# Altium schematic sheet IP6518C供电.SchDoc
size A2
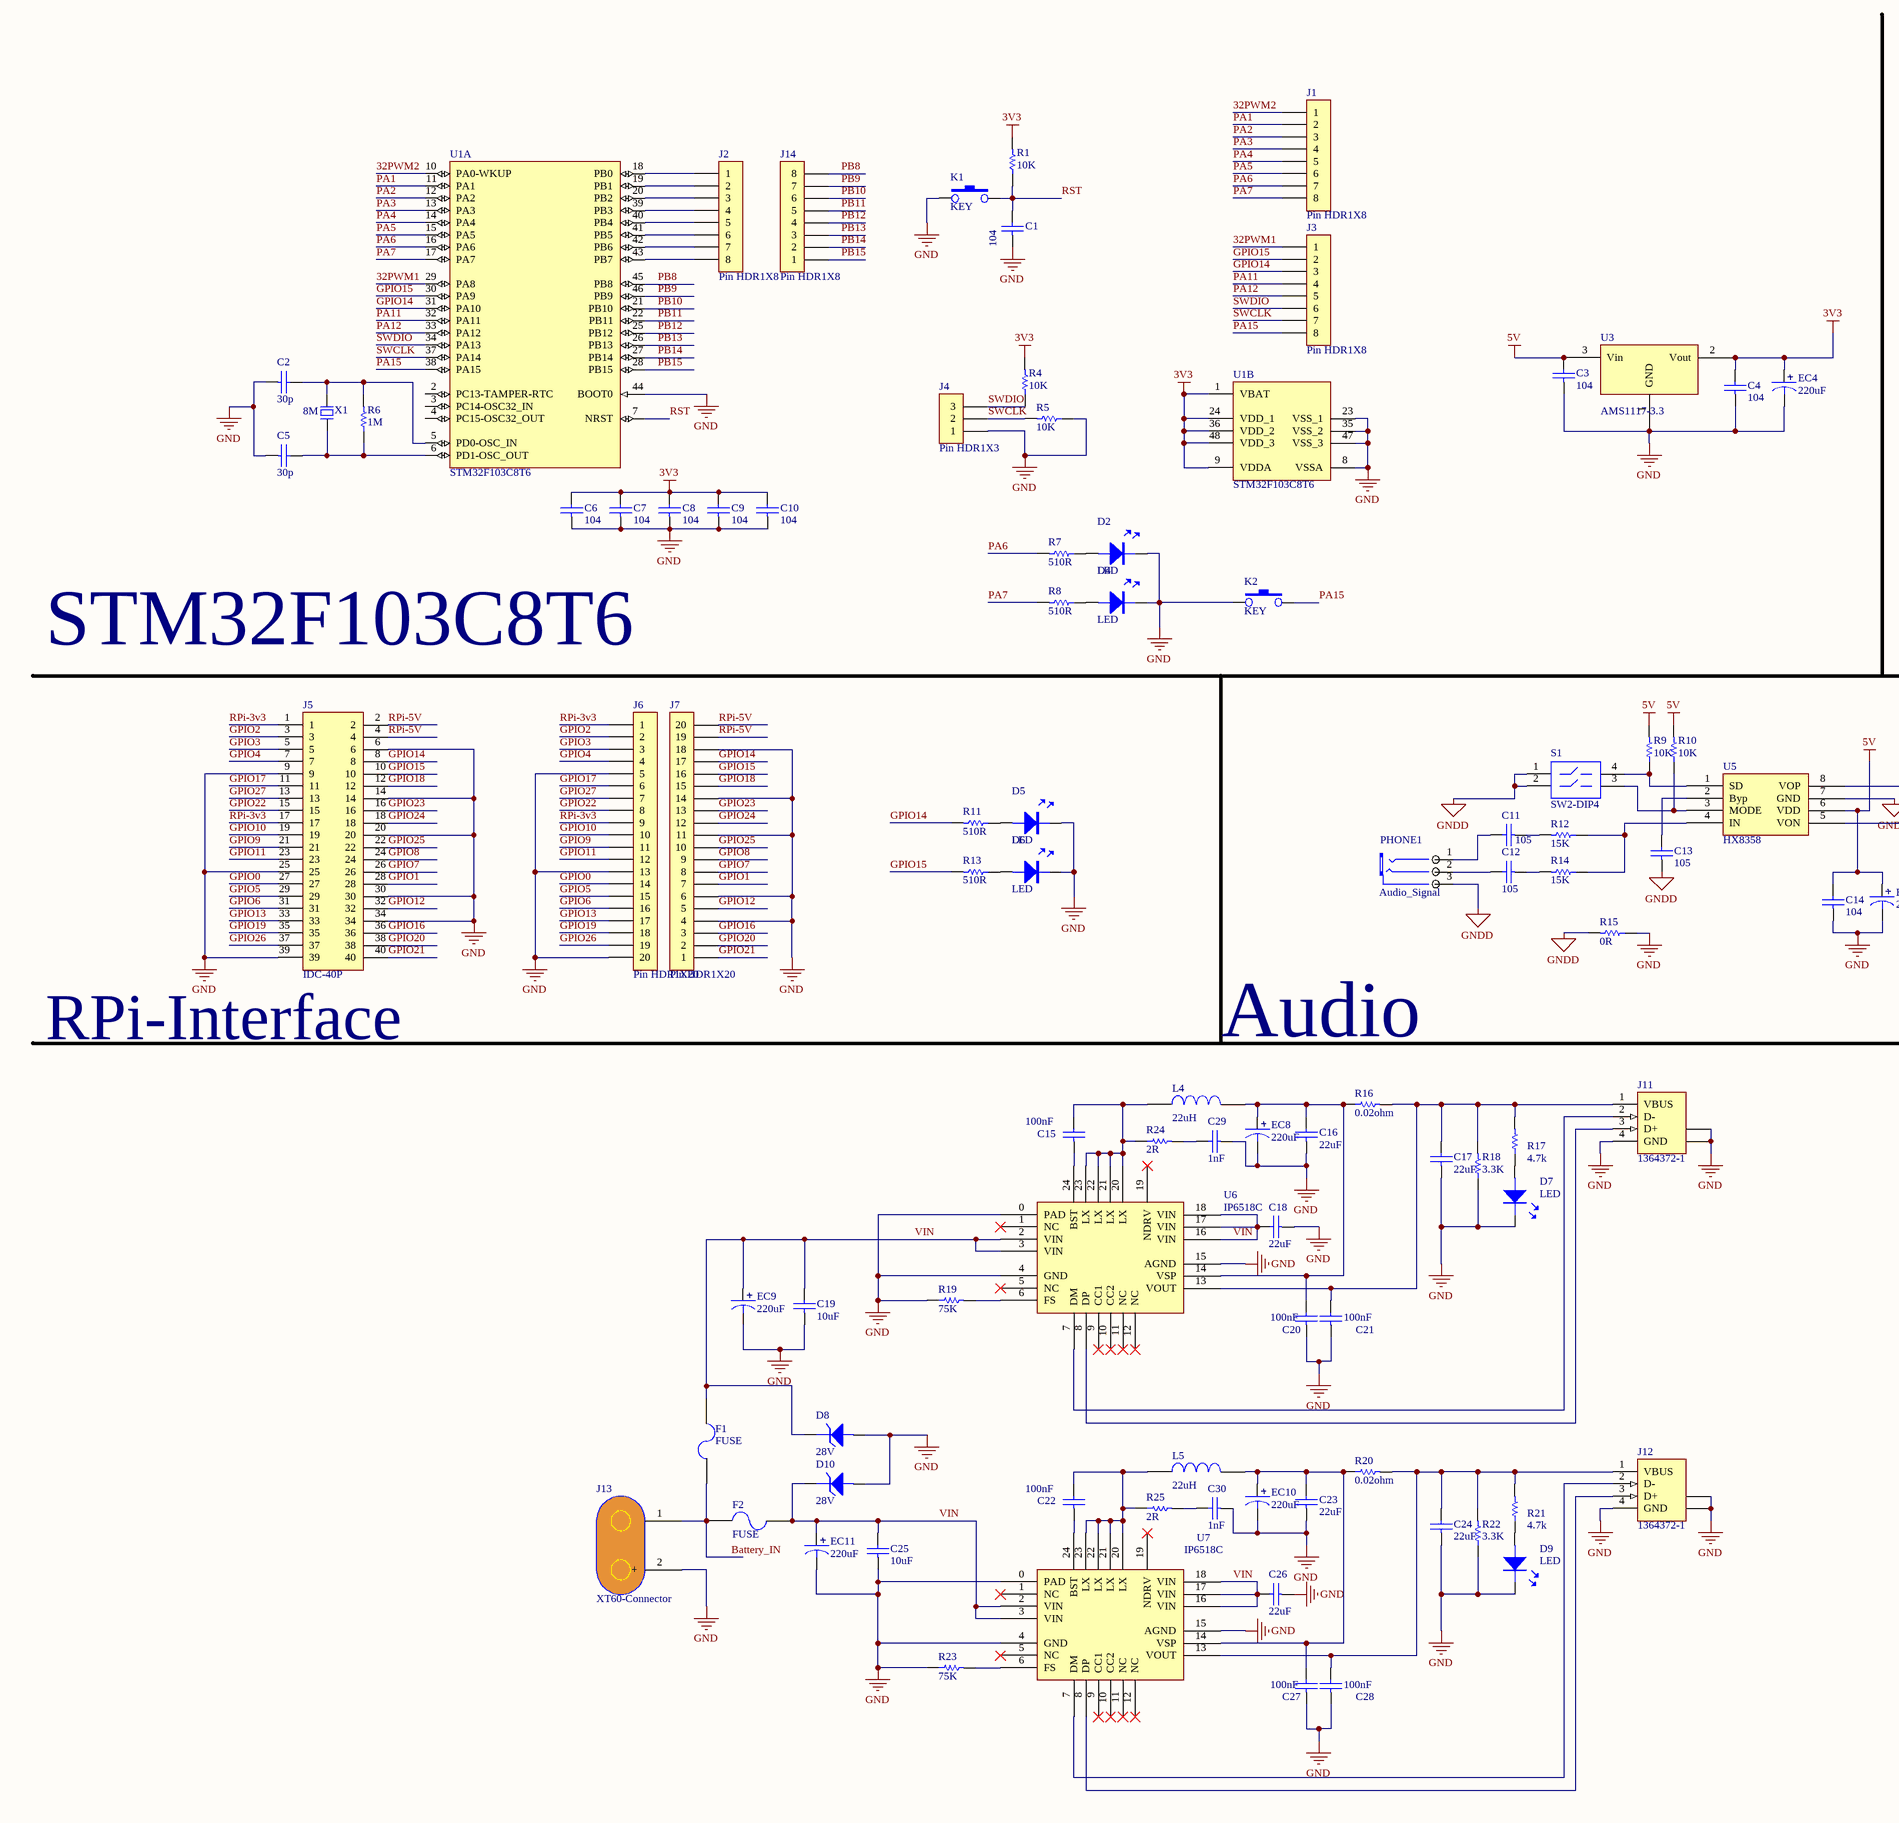
[diagram p0: IP6518C供电.SchDoc, left]
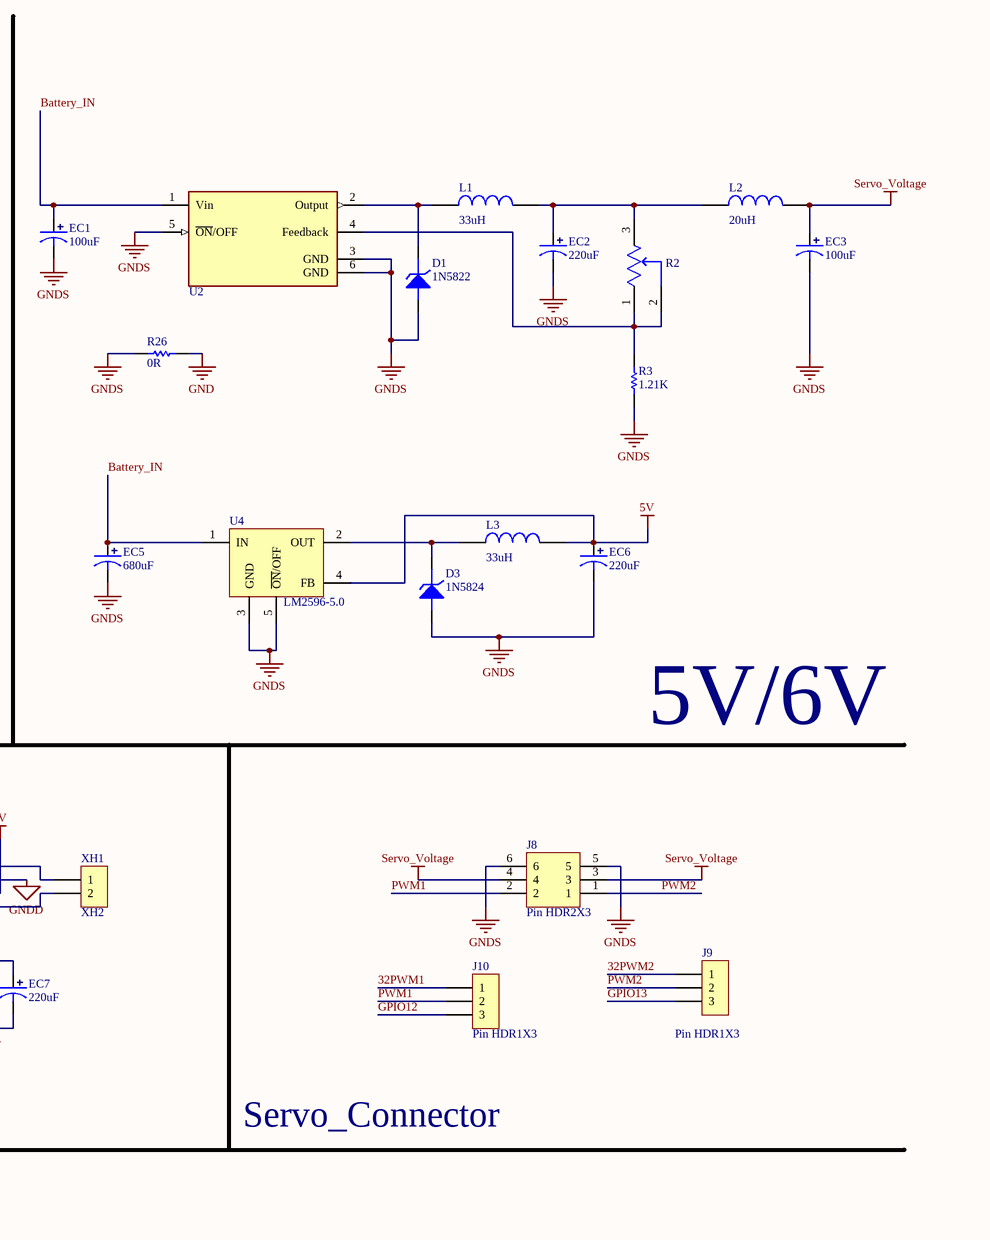
[diagram p1: IP6518C供电.SchDoc, right]

## Parts
C1  104  [0805C]
C2  30p  [0805C]
C3  104  [0805C]
C4  104  [0805C]
C5  30p  [0805C]
C6  104  [0805C]
C7  104  [0805C]
C8  104  [0805C]
C9  104  [0805C]
C10  104  [0805C]
C11  105  [0805C]
C12  105  [0805C]
C13  105  [0805C]
C14  104  [0805C]
C15  100nF  [0805C]
C16  22uF  [1206C]
C17  22uF  [1206C]
C18  22uF  [1206C]
C19  10uF  [1206C]
C20  100nF  [0805C]
C21  100nF  [0805C]
C22  100nF  [0805C]
C23  22uF  [1206C]
C24  22uF  [1206C]
C25  10uF  [1206C]
C26  22uF  [1206C]
C27  100nF  [0805C]
C28  100nF  [0805C]
C29  1nF  [0805C]
C30  1nF  [0805C]
D1  1N5822  [SMA/DO-214AC]
D2  LED  [LED-0805R]
D3  1N5824  [SMA/DO-214AC]
D4  LED  [LED-0805R]
D5  LED  [LED-0805R]
D6  LED  [LED-0805R]
D7  LED  [LED-0805R]
D8  28V  [SMA/DO-214AC]
D9  LED  [LED-0805R]
D10  28V  [SMA/DO-214AC]
EC1  100uF  [SMD-EC6.3X6.3X10]
EC2  220uF  [SMD-EC8X8X10]
EC3  100uF  [SMD-EC6.3X6.3X10]
EC4  220uF  [SMD-EC8X8X10]
EC5  680uF  [DIP-EC10X17]
EC6  220uF  [SMD-EC8X8X10]
EC7  220uF  [SMD-EC8X8X10]
EC8  220uF  [SMD-EC8X8X10]
EC9  220uF  [SMD-EC10X10X10]
EC10  220uF  [SMD-EC8X8X10]
EC11  220uF  [SMD-EC10X10X10]
F1  FUSE  [FUSE-1812]
F2  FUSE  [FUSE-1812]
J1  Pin HDR1X8  [Pin HDR1X8/2.54mm-S]
J2  Pin HDR1X8  [Pin HDR1X8/2.54mm-S]
J3  Pin HDR1X8  [Pin HDR1X8/2.54mm-S]
J4  Pin HDR1X3  [Pin HDR1X3/2.54mm-S]
J5  IDC-40P  [IDC2.54-40P]
J6  Pin HDR1X20  [Pin HDR1X20/2.54mm-S]
J7  Pin HDR1X20  [Pin HDR1X20/2.54mm-S]
J8  Pin HDR2X3  [Pin HDR2X3/2.54mm-S]
J9  Pin HDR1X3  [Pin HDR1X3/2.54mm-S]
J10  Pin HDR1X3  [Pin HDR1X3/2.54mm-S]
J11  1364372-1  [440068]
J12  1364372-1  [440068]
J13  XT60-Connector  [TX60PW-M20]
J14  Pin HDR1X8  [Pin HDR1X8/2.54mm-S]
K1  KEY  [SMD-3X6X4.3]
K2  KEY  [SMD-3X6X4.3]
L1  33uH  [CDRH74]
L2  20uH  [CDRH74]
L3  33uH  [CDRH74]
L4  22uH  [CDRH127]
L5  22uH  [CDRH129]
PHONE1  Audio_Signal  [PHONE_ST]
R1  10K  [0805R]
R2  3296W-1-504LF 50K  [Bourns_3296W_MFG]  (value not drawn)
R3  1.21K  [0805R]
R4  10K  [0805R]
R5  10K  [0805R]
R6  1M  [0805R]
R7  510R  [0805R]
R8  510R  [0805R]
R9  10K  [0805R]
R10  10K  [0805R]
R11  510R  [0805R]
R12  15K  [0805R]
R13  510R  [0805R]
R14  15K  [0805R]
R15  0R  [0805R]
R16  0.02ohm  [1206R]
R17  4.7k  [0805R]
R18  3.3K  [0805R]
R19  75K  [0805R]
R20  0.02ohm  [1206R]
R21  4.7k  [0805R]
R22  3.3K  [0805R]
R23  75K  [0805R]
R24  2R  [0805R]
R25  2R  [0805R]
R26  0R  [0805R]
S1  SW2-DIP4  [DIP-Switch2]
U1  STM32F103C8T6  [STM-LQFP48_N]  (parts A,B of 2)
U2  LM2596DSADJG  [ON_Semiconductor_936A-02_MFG]  (value not drawn)
U3  AMS1117-3.3  [SOT223]
U4  LM2596-5.0  [TO263-5A]
U5  HX8358  [SOP8-9]
U6  IP6518C  [QFN24]
U7  IP6518C  [QFN24]
X1  8M  [OSC HC-49SMD]
XH1  XH2  [XH2/2.54mm/90]

## Nets
3V3: C4.2 C6.2 C7.2 C8.2 C9.2 C10.2 EC4.1 R1.2 R4.2 U1.1(VBAT) U1.9(VDDA) U1.24(VDD_1) U1.36(VDD_2) U1.48(VDD_3) U3.2(Vout)
5V: C3.2 C14.2 EC6.1 EC7.1 L3.2 R9.2 R10.2 U3.3(Vin) U4.4(FB) U5.6(VDD)
GND: C1.1 C2.1 C3.1 C4.1 C5.1 C6.1 C7.1 C8.1 C9.1 C10.1 C14.1 C16.1 C17.1 C18.1 C19.1 C20.1 C21.1 C23.1 C24.1 C25.1 C26.1 C27.1 C28.1 C29.1 C30.1 D2.K D4.K D5.K D6.K D7.K D8.A D9.K D10.A EC4.2 EC7.2 EC8.2 EC9.2 EC10.2 EC11.2 J4.1 J5.6 J5.9 J5.14 J5.20 J5.25 J5.30 J5.34 J5.39 J6.5 J6.13 J6.20 J7.4 J7.6 J7.11 J7.14 J7.18 J11.4(GND) J11.5(SHLD) J11.6(SHLD) J12.4(GND) J12.5(SHLD) J12.6(SHLD) J13.2(+) K1.1 K2.1 R5.1 R15.1 R18.1 R19.1 R22.1 R23.1 R26.1 U1.8(VSSA) U1.23(VSS_1) U1.35(VSS_2) U1.44(BOOT0) U1.47(VSS_3) U3.1(GND) U6.0(PAD) U6.4(GND) U6.15(AGND) U7.0(PAD) U7.4(GND) U7.15(AGND)
GNDD: C13.1 PHONE1.3(COM) R15.2 S1.1(A1) S1.2(A2) U5.7(GND)
GNDS: D1.A D3.A EC1.2 EC2.2 EC3.2 EC5.2 EC6.2 J8.5 J8.6 R3.1 R26.2 U2.3(GND) U2.5(~{ON}/OFF) U2.6(GND) U4.3(GND) U4.5(~{ON}/OFF)
Servo_Voltage: EC3.1 J8.3 J8.4 L2.2
32PWM1: J3.1 J10.1 U1.29(PA8)
32PWM2: J1.1 J9.1 U1.10(PA0-WKUP)
Battery_IN: EC1.1 EC5.1 F1.1 F2.2 J13.1 U2.1(Vin) U4.1(IN)
GPIO0: J5.27 J6.14
GPIO1: J5.28 J7.7
GPIO2: J5.3 J6.2
GPIO3: J5.5 J6.3
GPIO4: J5.7 J6.4
GPIO5: J5.29 J6.15
GPIO6: J5.31 J6.16
GPIO7: J5.26 J7.8
GPIO8: J5.24 J7.9
GPIO9: J5.21 J6.11
GPIO10: J5.19 J6.10
GPIO11: J5.23 J6.12
GPIO12: J5.32 J7.5 J10.3
GPIO13: J5.33 J6.17 J9.3
GPIO14: J3.3 J5.8 J7.17 R11.2 U1.31(PA10)
GPIO15: J3.2 J5.10 J7.16 R13.2 U1.30(PA9)
GPIO16: J5.36 J7.3
GPIO17: J5.11 J6.6
GPIO18: J5.12 J7.15
GPIO19: J5.35 J6.18
GPIO20: J5.38 J7.2
GPIO21: J5.40 J7.1
GPIO22: J5.15 J6.8
GPIO23: J5.16 J7.13
GPIO24: J5.18 J7.12
GPIO25: J5.22 J7.10
GPIO26: J5.37 J6.19
GPIO27: J5.13 J6.7
PA1: J1.2 U1.11(PA1)
PA2: J1.3 U1.12(PA2)
PA3: J1.4 U1.13(PA3)
PA4: J1.5 U1.14(PA4)
PA5: J1.6 U1.15(PA5)
PA6: J1.7 R7.2 U1.16(PA6)
PA7: J1.8 R8.2 U1.17(PA7)
PA11: J3.4 U1.32(PA11)
PA12: J3.5 U1.33(PA12)
PA15: J3.8 K2.3 U1.38(PA15)
PB8: J14.8 U1.45(PB8)
PB9: J14.7 U1.46(PB9)
PB10: J14.6 U1.21(PB10)
PB11: J14.5 U1.22(PB11)
PB12: J14.4 U1.25(PB12)
PB13: J14.3 U1.26(PB13)
PB14: J14.2 U1.27(PB14)
PB15: J14.1 U1.28(PB15)
PWM1: J8.2 J10.2
PWM2: J8.1 J9.2
RPi-3v3: J5.1 J5.17 J6.1 J6.9
RPi-5V: J5.2 J5.4 J7.19 J7.20
RST: C1.2 K1.3 R1.1 U1.7(NRST)
SWCLK: J3.7 J4.2 R5.2 U1.37(PA14)
SWDIO: J3.6 J4.3 R4.1 U1.34(PA13)
VIN: C18.2 C19.2 C25.2 C26.2 D8.K D10.K EC9.1 EC11.1 F1.2 F2.1 U6.2(VIN) U6.3(VIN) U6.16(VIN) U6.17(VIN) U6.18(VIN) U7.2(VIN) U7.3(VIN) U7.16(VIN) U7.17(VIN) U7.18(VIN)
NetC2_2: C2.2 R6.2 U1.5(PD0-OSC_IN) X1.2
NetC5_2: C5.2 R6.1 U1.6(PD1-OSC_OUT) X1.1
NetC11_1: C11.1 R12.2
NetC11_2: C11.2 PHONE1.1(CHL)
NetC12_1: C12.1 R14.2
NetC12_2: C12.2 PHONE1.2(CHR)
NetC13_2: C13.2 U5.2(Byp)
NetC15_1: C15.1 U6.24(BST)
NetC15_2: C15.2 L4.1 R24.1 U6.20(LX) U6.21(LX) U6.22(LX) U6.23(LX)
NetC16_2: C16.2 C20.2 EC8.1 L4.2 R16.1 U6.14(VSP)
NetC17_2: C17.2 C21.2 J11.1(VBUS) R16.2 R17.2 R18.2 U6.13(VOUT)
NetC22_1: C22.1 U7.24(BST)
NetC22_2: C22.2 L5.1 R25.1 U7.20(LX) U7.21(LX) U7.22(LX) U7.23(LX)
NetC23_2: C23.2 C27.2 EC10.1 L5.2 R20.1 U7.14(VSP)
NetC24_2: C24.2 C28.2 J12.1(VBUS) R20.2 R21.2 R22.2 U7.13(VOUT)
NetC29_2: C29.2 R24.2
NetC30_2: C30.2 R25.2
NetD1_K: D1.K L1.1 U2.2(Output)
NetD2_A: D2.A R7.1
NetD3_K: D3.K L3.1 U4.2(OUT)
NetD4_A: D4.A R8.1
NetD5_A: D5.A R11.1
NetD6_A: D6.A R13.1
NetD7_A: D7.A R17.1
NetD9_A: D9.A R21.1
NetEC2_1: EC2.1 L1.2 L2.1 R2.3(CW)
NetJ2_1: J2.1 U1.18(PB0)
NetJ2_2: J2.2 U1.19(PB1)
NetJ2_3: J2.3 U1.20(PB2)
NetJ2_4: J2.4 U1.39(PB3)
NetJ2_5: J2.5 U1.40(PB4)
NetJ2_6: J2.6 U1.41(PB5)
NetJ2_7: J2.7 U1.42(PB6)
NetJ2_8: J2.8 U1.43(PB7)
NetJ11_2: J11.2(D-) U6.7(DM)
NetJ11_3: J11.3(D+) U6.8(DP)
NetJ12_2: J12.2(D-) U7.7(DM)
NetJ12_3: J12.3(D+) U7.8(DP)
NetR2_1: R2.1(CCW) R2.2(WIPER) R3.2 U2.4(Feedback)
NetR9_1: R9.1 S1.4(B1) U5.1(SD)
NetR10_1: R10.1 S1.3(B2) U5.3(MODE)
NetR12_1: R12.1 R14.1 U5.4(IN)
NetR19_2: R19.2 U6.6(FS)
NetR23_2: R23.2 U7.6(FS)
NetU5_5: U5.5(VON) XH1.2
NetU5_8: U5.8(VOP) XH1.1

Not connected (* = marked no-connect by the designer): U1 2(PC13-TAMPER-RTC) 3(PC14-OSC32_IN) 4(PC15-OSC32_OUT); U6 1(NC)* 5(NC)* 9(CC1)* 10(CC2)* 11(NC)* 12(NC)* 19(NDRV)*; U7 1(NC)* 5(NC)* 9(CC1)* 10(CC2)* 11(NC)* 12(NC)* 19(NDRV)*

## Notes on the sheet
- STM32F103C8T6
- 5V/6V
- (near J5) RPi-Interface
- Audio
- Servo_Connector

## Library data of the parts
C1-C30 = CAP: 无极性电容
D1 D3 D8 D10 = DIODE ZENER: 稳压二极管
EC1-EC11 = SMD_ECAP: 贴片电解电容
J11 J12 = 1364372-1: USB 1.1, Right Angle, Thru-Hole, A Type, Receptacle, 4 Position, Black; ContactMaterial: Copper Alloy; ContactPlating: Gold (30) over Palladium Nickel; TerminationLength: 2.84mm [0.112in.]; PCB_Layout: Complies with manufacturer's recommendation.; DrillSize: Corresponds to nominal value.; PanelGround: Without; Published: 15-Jul-2004; DatasheetDocument: 11-Jan-2004; PackageDocument: 11-Jan-2004; PackageReference: 1364372; Publisher: Altium Limited; HousingMaterial: Thermoplastic; ComponentLink1Description: Manufacturer Link; ComponentLink1URL: http://www.tycoelectronics.com/; ComponentLink2Description: Packaging Specification; ComponentLink2URL: http://ecommas.tycoelectronics.com/commerce/DocumentDelivery/DDEController?Action=showdoc&DocId=Customer+Drawing%7F1364372%7FD%7Ftif%7FEnglish%7FENG_CD_1364372_D.tif
J13 = Component_1: 对于母头，+-对调
L1-L5 = INDUCTOR
PHONE1 = PHONE_M
R1 R3-R26 = RES
R2 = 3296W-1-504LF: RES TRIMMER 50K OHM 0.5W PC PIN TOP; Manufacturer: Bourns; Resistance: 500kΩ; Standoff Height: 0.38mm; Temperature Coefficient: 100ppm/°C; Tolerance: 10%; Value: 500kΩ; Verification Version: 0.0.0.3; Voltage Rating: 300V; Datasheet Path: datasheets/Res_Bourns_3296W-1-504LF_eec.pdf; Automotive: No; ComponentLink1Description: Upverter; ComponentLink1URL: https://upverter.com/part/id/e293c38b76cd9289/; ComponentLink2Description: Datasheet; ComponentLink2URL: https://www.bourns.com/docs/Product-Datasheets/3296.pdf; Digikey Description: RES TRIMMER 500K OHM 0.5W PC PIN TOP; Digikey Part Number: 3296W-504LF-ND; Height: 12.05mm; Lead Free: Yes; Mouser Description: Trimmer; Cermet; Rest 500 Kilohms; PCB; 25 Turns; Pwr-Rtg 0.5W; Mouser Part Number: 652-3296W-1-504LF; Package: 3296W; Part Number: 3296W-1-504LF; Power Rating: 0.5W; RoHS: TRUE; Series: Trimpot 3296-Sealed; Supplier 1: Digi-Key; Supplier 2: Mouser; Supplier Part Number 1: 3296W-504LF-ND; Supplier Part Number 2: 652-3296W-1-504LF; Temperature: -55°C to +125°C; Temperature Range High: +125°C; Temperature Range Low: -55°C; helpURL: https://upverter.com/part/id/e293c38b76cd9289/
U1 = STM32F103C8T6: ARM Cortex-M3 32-bit MCU, 64 KB Flash, 20 KB Internal RAM, 37 I/Os, 48-pin LQFP, -40 to 85 degC, Tray; A/D Converter: 2x12-bit (10 Channel); FLASH Size (Prog) (kB): 64; I/Os (High Current): 37; Internal RAM Size (kB): 20; Operating Frequency(F) (Processor speed) (MHz): 72; Supply Voltage(Vcc) min (V): 2; DatasheetVersion: Rev. 16; PackageVersion: Rev. 6, 06/2013; PackageReference: LQFP48; PackageDescription: 48-Pin Low Profile Quad Flat Package, 7 x 7 mm Body, 0.5 mm Pitch; Supplier 1: Digi-Key; Supplier Part Number 1: 497-6063-ND; Supplier 2: Farnell; Supplier Part Number 2: 1447637; Supplier 3: Newark; Supplier Part Number 3: 59M2182; Supplier 4: Newark; Supplier Part Number 4: 57P1222; Supplier 5: Mouser; Supplier Part Number 5: 511-STM32F103C8T6; Core: ARM Cortex-M3; Packing: Tray; Mounting Technology: Surface Mount; PartNumber: STM32F103C8T6; ComponentLink1Description: Manufacturer URL; ComponentLink1URL: http://www.st.com/web/en/home.html; ComponentLink2Description: Datasheet; ComponentLink2URL: http://www.st.com/st-web-ui/static/active/en/resource/technical/document/datasheet/CD00161566.pdf; ComponentLink3Description: Package Specification; ComponentLink3URL: http://www.st.com/st-web-ui/static/active/en/resource/technical/document/datasheet/DM00058181.pdf
U2 = LM2596DSADJG: IC REG MULT CONFG ADJ 3A D2PAK-5; Manufacturer: ON Semiconductor; Max Duty Cycle: 95%; Max Junction Temp: +125°C; Max Supply Voltage: 40V; Min Supply Voltage: 4.5V; Negative Voltage Available: true; Nominal Supply Current: 5mA; Number Of Outputs: 1; Output Type: AdjustableProgrammable; Output Voltage: 1.23-37V; Standoff Height: 0mm; Switching Frequency: 150Hz; Switching Topology: Boost,Buck,Buck-Boost; Verification Version: 0.0.0.3; Datasheet Path: datasheets/IC_ON_Semiconductor_LM2596DSADJG_eec.pdf; Automotive: No; ComponentLink1Description: Upverter; ComponentLink1URL: https://upverter.com/part/id/6f203cf7c6ae65e1/; ComponentLink2Description: Datasheet; ComponentLink2URL: https://www.onsemi.com/pub/Collateral/LM2596-D.PDF; Digikey Description: IC REG MULT CONFG ADJ 3A D2PAK-5; Digikey Part Number: LM2596DSADJGOS-ND; Footprint Url: https://www.onsemi.com/pub/Collateral/936A-02.PDF; Height: 4.826mm; Lead Free: Yes; Mouser Description: Voltage Regulators - Switching Regulators 3A BUCK SWCH 150KHZ; Mouser Part Number: 863-LM2596DSADJG; Output Current: 3A; Package: 936A-02; Part Number: LM2596DSADJG; RoHS: TRUE; Supplier 1: Digi-Key; Supplier 2: Mouser; Supplier Part Number 1: LM2596DSADJGOS-ND; Supplier Part Number 2: 863-LM2596DSADJG; Temperature: -40°C to +125°C; Temperature Range High: +125°C; Temperature Range Low: -40°C; helpURL: https://upverter.com/part/id/6f203cf7c6ae65e1/
U3 = AMS1117: 三端稳压芯片
U4 = LM2596-5.0: DC降压芯片
X1 = XTAL-2P: 2脚无源脚晶振